# Altium schematic sheet BEE_BOARD_BLOCK_DIAG.SchDoc
size Tabloid; DocumentNumber: 2; SheetNumber: 2; SheetTotal: 6; Sheet_Name: Insert name in Document Parameters; Size: 11x17
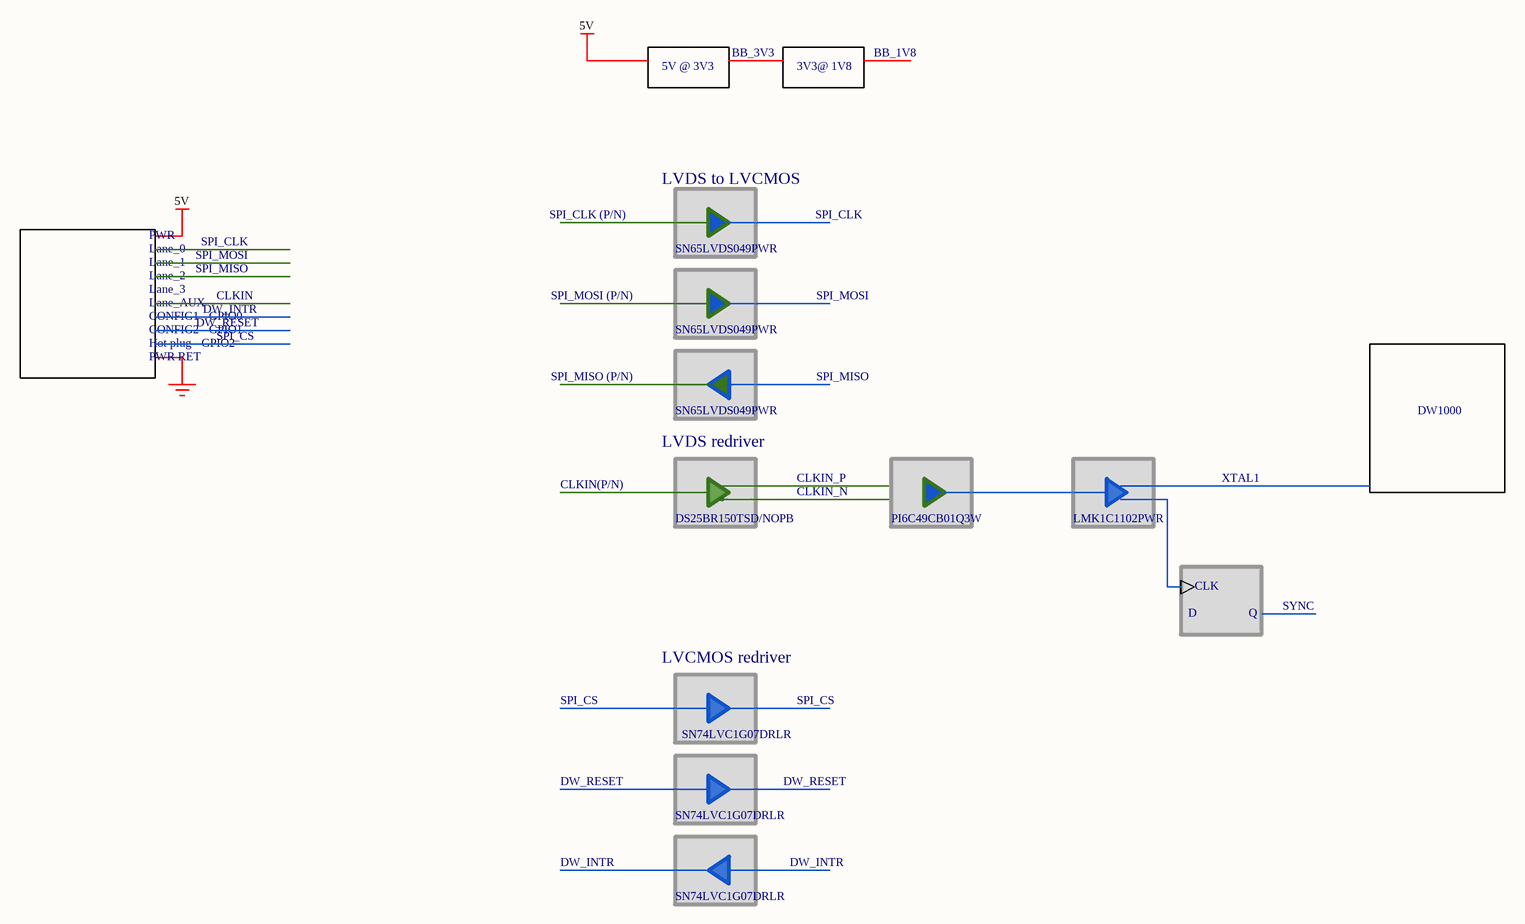
[diagram p0: BEE_BOARD_BLOCK_DIAG.SchDoc]

## Notes on the sheet
- 5V
- 5V @ 3V3
- BB_3V3
- 3V3@ 1V8
- BB_1V8
- Lane_0
- PWR
- SPI_CLK
- SPI_CLK (P/N)
- LVDS to LVCMOS
- SN65LVDS049PWR
- Lane_1
- Lane_2
- Lane_3
- Lane_AUX
- DW_INTR
- CLKIN
- SPI_MOSI
- SPI_MISO
- SPI_MOSI (P/N)
- CONFIG1 - GPIO0
- CONFIG2 - GPIO1
- Hot plug - GPIO2
- PWR RET
- DW_RESET
- SPI_CS
- SPI_MISO (P/N)
- LVDS redriver
- DW1000
- CLKIN(P/N)
- DS25BR150TSD/NOPB
- CLKIN_P
- CLKIN_N
- PI6C49CB01Q3W
- LMK1C1102PWR
- XTAL1
- D
- CLK
- Q
- SYNC
- LVCMOS redriver
- SN74LVC1G07DRLR
- Sheet Name
- Project Title
- Global Project
- Size
- Group
- Revision
- Date
- Sheet
- of
- Filename
- Designers